# EAGLE schematic Escorna_CPU_1_01 (EAGLE 6.4)
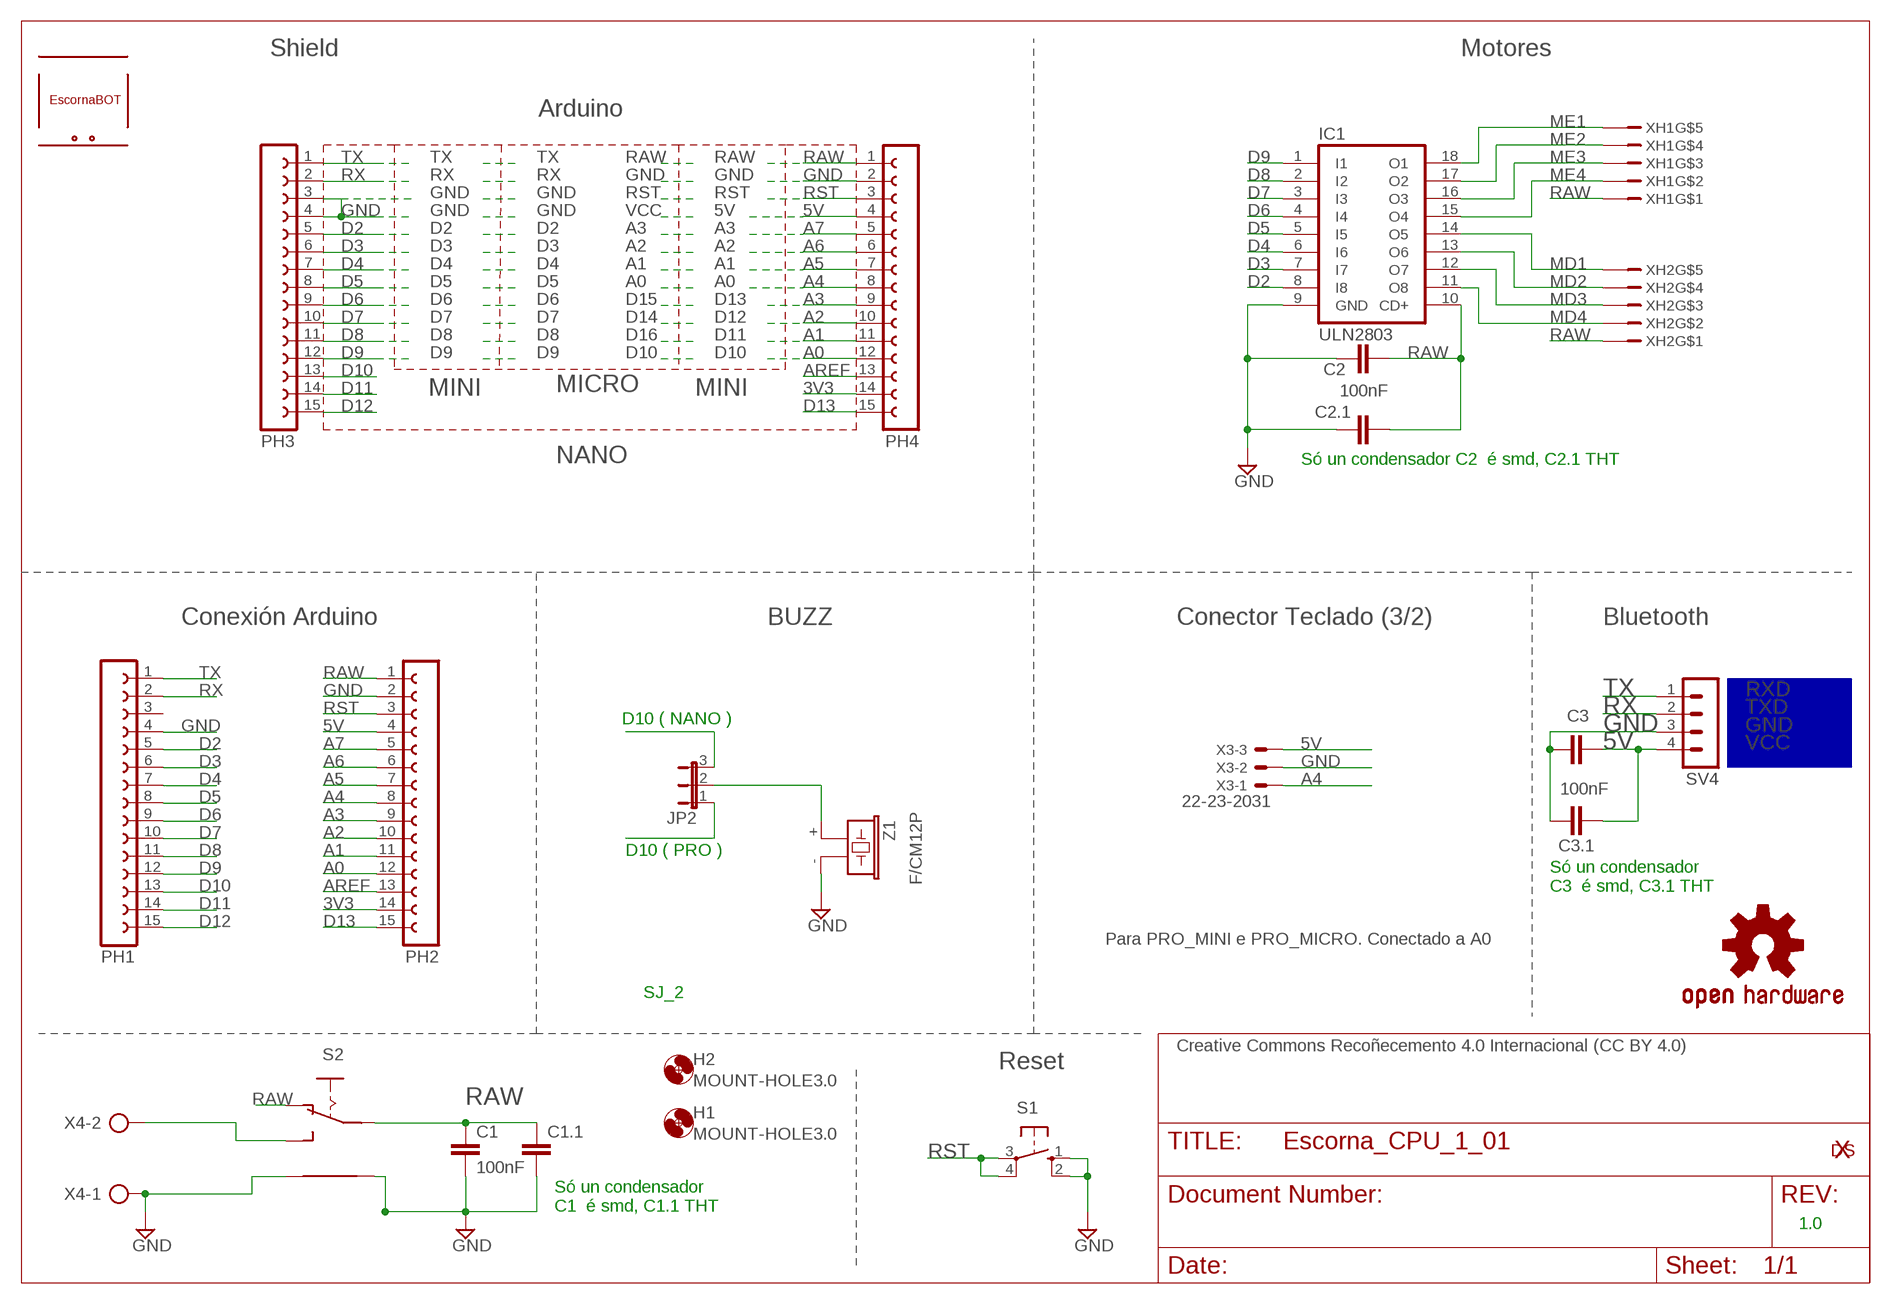
[diagram p0: schematic, sheet 1]

## Parts
C1  100nF  C-EUC1206  [C1206]
C1.1  C-EU025-024X044  [C025-024X044]
C2  100nF  C-EUC1206  [C1206]
C2.1  C-EU025-024X044  [C025-024X044]
C3  100nF  C-EUC1206  [C1206]
C3.1  C-EU025-024X044  [C025-024X044]
H1  MOUNT-HOLE3.0  [3,0]
H2  MOUNT-HOLE3.0  [3,0]
IC1  ULN2803  ULN2803A"  [DIL18]
JP2  JP2E  [JP2]
LOGO1  OSHW-LOGOS  [OSHW-LOGO-S]
PH1  FE15-1  [FE15]
PH2  FE15-1  [FE15]
PH3  FE15-1  [FE15]
PH4  FE15-1  [FE15]
S1  10-XX  [B3F-10XX]
S2  SK12F14F  [SK-12F14-G]
SV4  MA04-1  [MA04-1]
U$1  ESCORNABOT  [ESCORNA_PEQUE]
U$6  XDESIG  [XDESIG_CU_2]
X3  22-23-2031  [22-23-2031]
X4  AK500/2  [AK500/2]
XH1  B5B-XH-A  [B5B-XH-A]
XH2  B5B-XH-A  [B5B-XH-A]
Z1  F/CM12P  [F/CM12P]

## Nets
3V3: PH2.14 PH4.14
5V: C3.1.2 C3.2 PH2.4 PH4.4 SV4.4 X3.3
A0: JP2.1 PH2.12 PH4.12
A1: PH2.11 PH4.11
A2: PH2.10 PH4.10
A3: PH2.9 PH4.9
A4: PH2.8 PH4.8 X3.1
A5: PH2.7 PH4.7
A6: PH2.6 PH4.6
A7: PH2.5 PH4.5
AREF: PH2.13 PH4.13
D2: IC1.8(I8) PH1.5 PH3.5
D3: IC1.7(I7) PH1.6 PH3.6
D4: IC1.6(I6) PH1.7 PH3.7
D5: IC1.5(I5) PH1.8 PH3.8
D6: IC1.4(I4) PH1.9 PH3.9
D7: IC1.3(I3) PH1.10 PH3.10
D8: IC1.2(I2) PH1.11 PH3.11
D9: IC1.1(I1) PH1.12 PH3.12
D10: JP2.3 PH1.13 PH3.13
D11: PH1.14 PH3.14
D12: PH1.15 PH3.15
D13: PH2.15 PH4.15
GND: C1.1.2 C1.2 C2.1 C2.1.1 C3.1 C3.1.1 IC1.9(GND) PH1.4 PH2.2 PH3.3 PH3.4 PH4.2 S1.1(S) S1.2(S1) S2.P$4 S2.P$5 SV4.3 X3.2 X4.1 Z1.-
MD1: IC1.14(O5) XH2.P$5
MD2: IC1.13(O6) XH2.P$4
MD3: IC1.12(O7) XH2.P$3
MD4: IC1.11(O8) XH2.P$2
ME1: IC1.18(O1) XH1.P$5
ME2: IC1.17(O2) XH1.P$4
ME3: IC1.16(O3) XH1.P$3
ME4: IC1.15(O4) XH1.P$2
N$2: JP2.2 Z1.+
N$3: S2.P$3(S) X4.2
RAW: C1.1 C1.1.1 C2.1.2 C2.2 IC1.10(CD+) PH2.1 PH4.1 S2.P$1(P) S2.P$2(O) XH1.P$1 XH2.P$1
RST: PH2.3 PH4.3 S1.3(P) S1.4(P1)
RX: PH1.2 PH3.2 SV4.2
TX: PH1.1 PH3.1 SV4.1
Unconnected: PH1.3

## Notes on the sheet
- Shield | Motores
- Arduino
- TX | TX | RAW | RAW
- RX | RX | GND | GND
- GND | GND | RST | RST
- GND | GND | VCC | 5V
- D2 | D2 | A3 | A3
- D3 | D3 | A2 | A2
- D4 | D4 | A1 | A1
- D5 | D5 | A0 | A0
- D6 | D6 | D15 | D13
- D7 | D7 | D14 | D12
- D8 | D8 | D16 | D11
- D9 | D9 | D10 | D10
- MINI | MINI
- MICRO
- NANO | Só un condensador C2  é smd, C2.1 THT
- Conexión Arduino | BUZZ | Conector Teclado (3/2) | Bluetooth
- RXD
- TXD
- D10 ( NANO )
- GND
- VCC
- D10 ( PRO )
- Só un condensador 
  C3  é smd, C3.1 THT
- Para PRO_MINI e PRO_MICRO. Conectado a A0
- SJ_2
- Creative Commons Recoñecemento 4.0 Internacional (CC BY 4.0)
- Reset
- Só un condensador 
  C1  é smd, C1.1 THT
- 1.0

## Library data of the parts
C1 C1.1 C2 C2.1 C3 C3.1 = rcl:C-EU: CAPACITOR, European symbol
H1 H2 = holes:MOUNT-HOLE: MOUNTING HOLE with drill center marker
IC1 = uln-udn:ULN2803A: DRIVER ARRAY
JP2 = jumper:JP2E: JUMPER
LOGO1 = SparkFun-Aesthetics:OSHW-LOGO: Open Source Hardware Logo This logo indicates the piece of hardware it is found on incorporates a OSHW license and/or adheres to the definition of open source hardware found here: http://freedomdefined.org/OSHW
PH1-PH4 = con-lsta:FE15-1: FEMALE HEADER; OC_FARNELL: unknown; OC_NEWARK: unknown
S1 = switch-omron:10-XX: OMRON SWITCH; MPN: B3F-1000; OC_FARNELL: 176432; OC_NEWARK: 36M3542
S2 = escorna:SK12F14
SV4 = con-lstb:MA04-1: PIN HEADER; OC_FARNELL: unknown; OC_NEWARK: unknown
U$1 = escorna:ESCORNABOT
U$6 = xdesig:XDESIG
X3 = con-molex:22-23-2031: .100" (2.54mm) Center Header - 3 Pin; MF: MOLEX; MPN: 22-23-2031; OC_FARNELL: 1462950; OC_NEWARK: 30C0862
X4 = con-ptr500:AK500/2: CONNECTOR; OC_FARNELL: unknown; OC_NEWARK: unknown
XH1 XH2 = con-jst:B5B-XH-A
Z1 = buzzer:F/CM12P: BUZZER Source: Buerklin; OC_FARNELL: unknown; OC_NEWARK: unknown

## Net classes
0 default: clearance 0.355 mm